# EAGLE schematic rase001 (EAGLE 8.0.1)
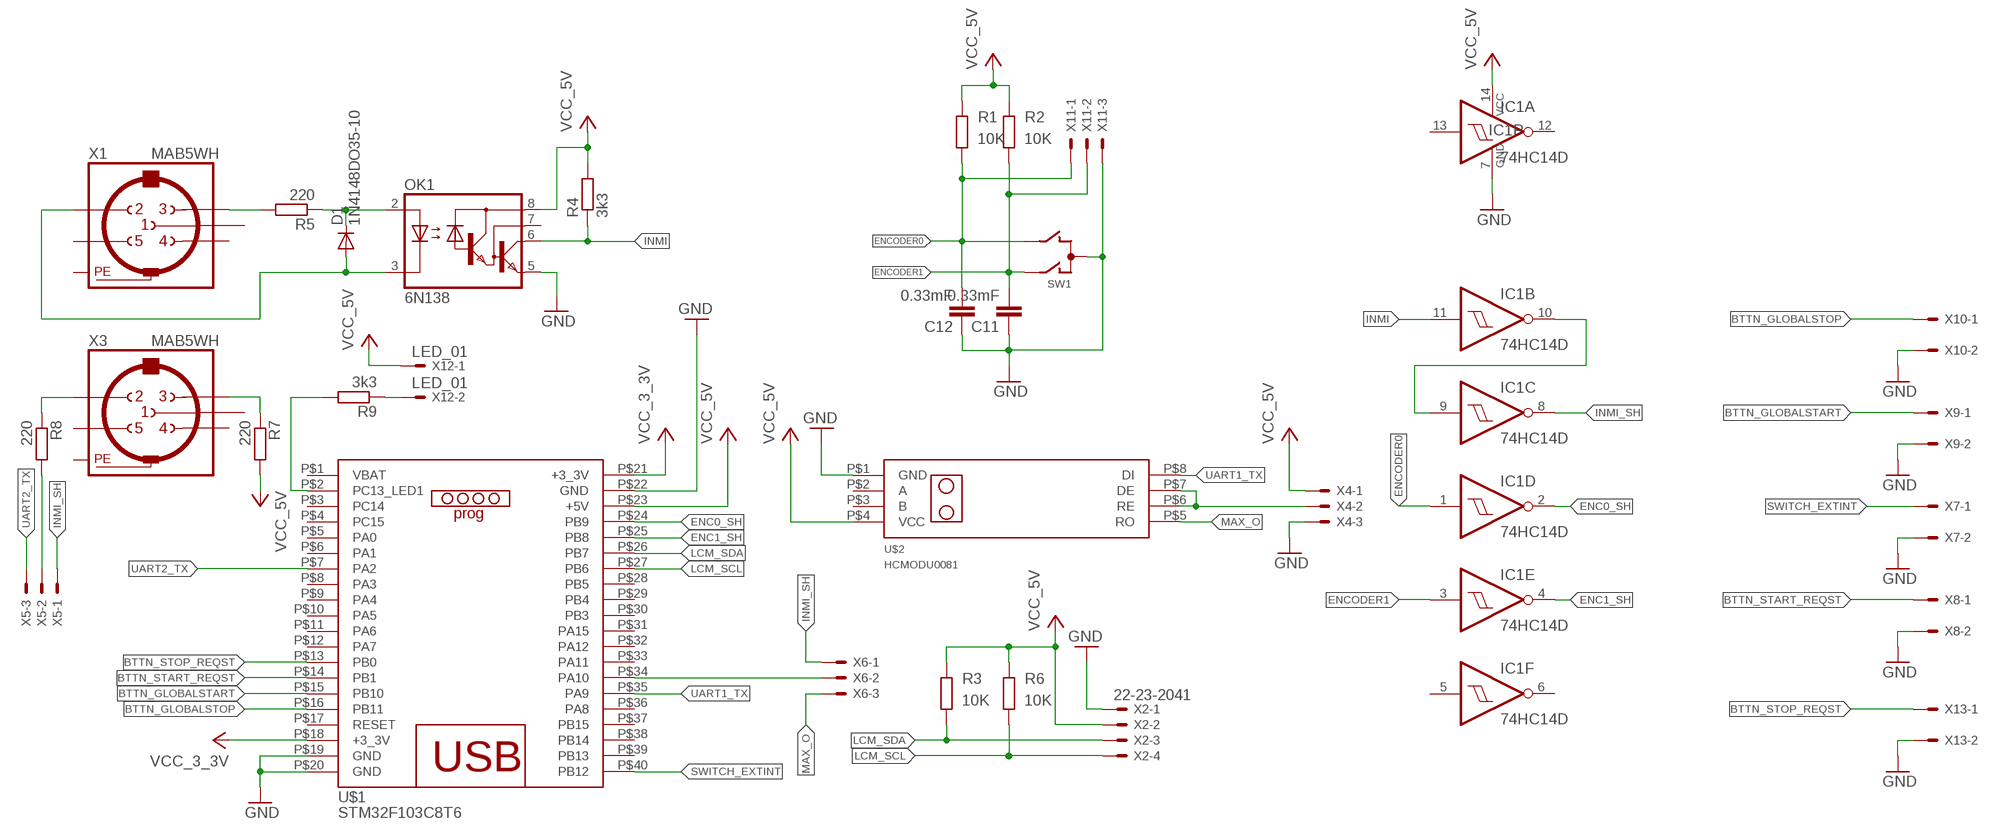
[diagram p0: schematic, sheet 1]

## Parts
C11  0.33mF  C-1206  [C1206]
C12  0.33mF  C-1206  [C1206]
D1  1N4148DO35-10  [DO35-10]
IC1  74HC14D  [SO14]
OK1  6N138  [DIL08]
R1  10K  R-R1206  [R1206]
R2  10K  R-R1206  [R1206]
R3  10K  R-R1206  [R1206]
R4  3k3  R-EU_M1206  [M1206]
R5  220  R-EU_M1206  [M1206]
R6  10K  R-R1206  [R1206]
R7  220  R-EU_M1206  [M1206]
R8  220  R-EU_M1206  [M1206]
R9  3k3  R-EU_M1206  [M1206]
SW1  EC12E_SW  [ALPS_EC12E_SW]
U$1  STM32F103C8T6  [STM32F103C8T6]
U$2  HCMODU0081  [HCMODU0081]
X1  MAB5WH  [MAB5WH]
X2  22-23-2041  [22-23-2041]
X3  MAB5WH  [MAB5WH]
X4  KK-156-3  [KK-156-3]
X5  KK-156-3  [KK-156-3]
X6  KK-156-3  [KK-156-3]
X7  KK-156-2  [KK-156-2]
X8  KK-156-2  [KK-156-2]
X9  KK-156-2  [KK-156-2]
X10  KK-156-2  [KK-156-2]
X11  KK-156-3  [KK-156-3]
X12  LED_01  KK-156-2  [KK-156-2]
X13  KK-156-2  [KK-156-2]

## Nets
BTTN_GLOBALSTART: U$1.P$15(PB10) X9.1
BTTN_GLOBALSTOP: U$1.P$16(PB11) X10.1
BTTN_START_REQST: U$1.P$14(PB1) X8.1
BTTN_STOP_REQST: U$1.P$13(PB0) X13.1
ENC0_SH: IC1.2(D:O) U$1.P$24(PB9)
ENC1_SH: IC1.4(E:O) U$1.P$25(PB8)
ENCODER0: C12.2 R1.2 SW1.B X11.1
ENCODER1: C11.2 R2.2 SW1.A X11.2
GND: C11.1 C12.1 IC1.7(P:GND) OK1.5(GND) SW1.C U$1.P$19(GND) U$1.P$20(GND) U$1.P$22(GND) U$2.P$1(GND) X2.1 X4.3 X7.2 X8.2 X9.2 X10.2 X11.3 X13.2
INMI: OK1.6(VO) R4.1
INMI_SH: IC1.8(C:O) X5.1 X6.1
LCM_SCL: R6.2 U$1.P$27(PB6) X2.4
LCM_SDA: R3.2 U$1.P$26(PB7) X2.3
MAX_O: U$2.P$5(RO) X6.3
N$1: R8.1 X3.2
N$2: R7.1 X3.3
N$3: IC1.9(C:I) IC1.10(B:O)
N$4: D1.C OK1.2(A) R5.1
N$5: R5.2 X1.3
N$6: D1.A OK1.3(C) X1.2
N$7: R8.2 X5.2
N$8: R9.1 X12.2
N$10: U$1.P$34(PA10) X6.2
N$11: U$2.P$6(RE) U$2.P$7(DE) X4.2
N$12: R9.2 U$1.P$2(PC13_LED1)
SWITCH_EXTINT: U$1.P$40(PB12) X7.1
UART1_TX: U$1.P$35(PA9) U$2.P$8(DI)
UART2_TX: U$1.P$7(PA2) X5.3
VCC: IC1.14(P:VCC) ; supply symbol labelled VCC_5V
VCC_3V: U$1.P$18(+3_3V) U$1.P$21(+3_3V) ; supply symbol labelled VCC_3_3V
VCC_5V: OK1.8(VCC) R1.1 R2.1 R3.1 R4.2 R6.1 R7.2 U$1.P$23(+5V) U$2.P$4(VCC) X2.2 X4.1 X12.1
Unconnected: IC1.1(D:I) IC1.3(E:I) IC1.5(F:I) IC1.6(F:O) IC1.11(B:I) IC1.12(A:O) IC1.13(A:I) OK1.7(VB) SW1.D SW1.E SW1.GND1(G) SW1.GND2(G) U$1.P$1(VBAT) U$1.P$3(PC14) U$1.P$4(PC15) U$1.P$5(PA0) U$1.P$6(PA1) U$1.P$8(PA3) U$1.P$9(PA4) U$1.P$10(PA5) U$1.P$11(PA6) U$1.P$12(PA7) U$1.P$17(RESET) U$1.P$28(PB5) U$1.P$29(PB4) U$1.P$30(PB3) U$1.P$31(PA15) U$1.P$32(PA12) U$1.P$33(PA11) U$1.P$36(PA8) U$1.P$37(PB15) U$1.P$38(PB14) U$1.P$39(PB13) U$2.P$2(A) U$2.P$3(B) X1.1 X1.4 X1.5 X3.1 X3.4 X3.5

## Power pins joined to a net without a drawn wire
PE: X1.PE X1.PE@(PE) X3.PE X3.PE@(PE)

## Library data of the parts
C11 C12 = quantum-sensor:C: Capacitor
D1 = diode:1N4148: DIODE high speed (Philips)
IC1 = 74xx-eu:74*14: Hex schmitt trigger INVERTER
OK1 = optocoupler:6N138: MOTOROLA OPTO COUPLER
R1-R3 R6 = quantum-sensor:R: Resistor
R4 R5 R7-R9 = rcl:R-EU_: RESISTOR, European symbol
SW1 = switch-alps:EC12E_SW: ALPS rotary Encoder EC12E series with switch
U$1 = ali_exp_morsels:STM32F103C8T6: STM32F103C8T6 stm32 STM32 STM32F103
U$2 = ali_exp_morsels:HCMODU0081: HCMODU0081 hcmodu0081 rs485 RS485
X1 X3 = con-hirschmann:MAB5WH: Female CONNECTOR 5 pins with shield, horizontal (DIN 45327); OC_FARNELL: unknown; OC_NEWARK: unknown
X2 = con-molex:22-23-2041: .100" (2.54mm) Center Header - 4 Pin; MF: MOLEX; MPN: 22-23-2041; OC_FARNELL: 1462920; OC_NEWARK: 38C0355
X4-X6 X11 = con-molex:KK-156-3: KK 156 HEADER Source: http://www.molex.com/pdm_docs/sd/026604100_sd.pdf; OC_FARNELL: unknown; OC_NEWARK: unknown
X7-X10 X12 X13 = con-molex:KK-156-2: KK 156 HEADER Source: http://www.molex.com/pdm_docs/sd/026604100_sd.pdf; OC_FARNELL: unknown; OC_NEWARK: unknown

## Net classes
1 power: width 0.762 mm
6 net8: width 0.203 mm